# Altium schematic sheet Main.SchDoc
size A4; SheetNumber: 1; SheetTotal: 7
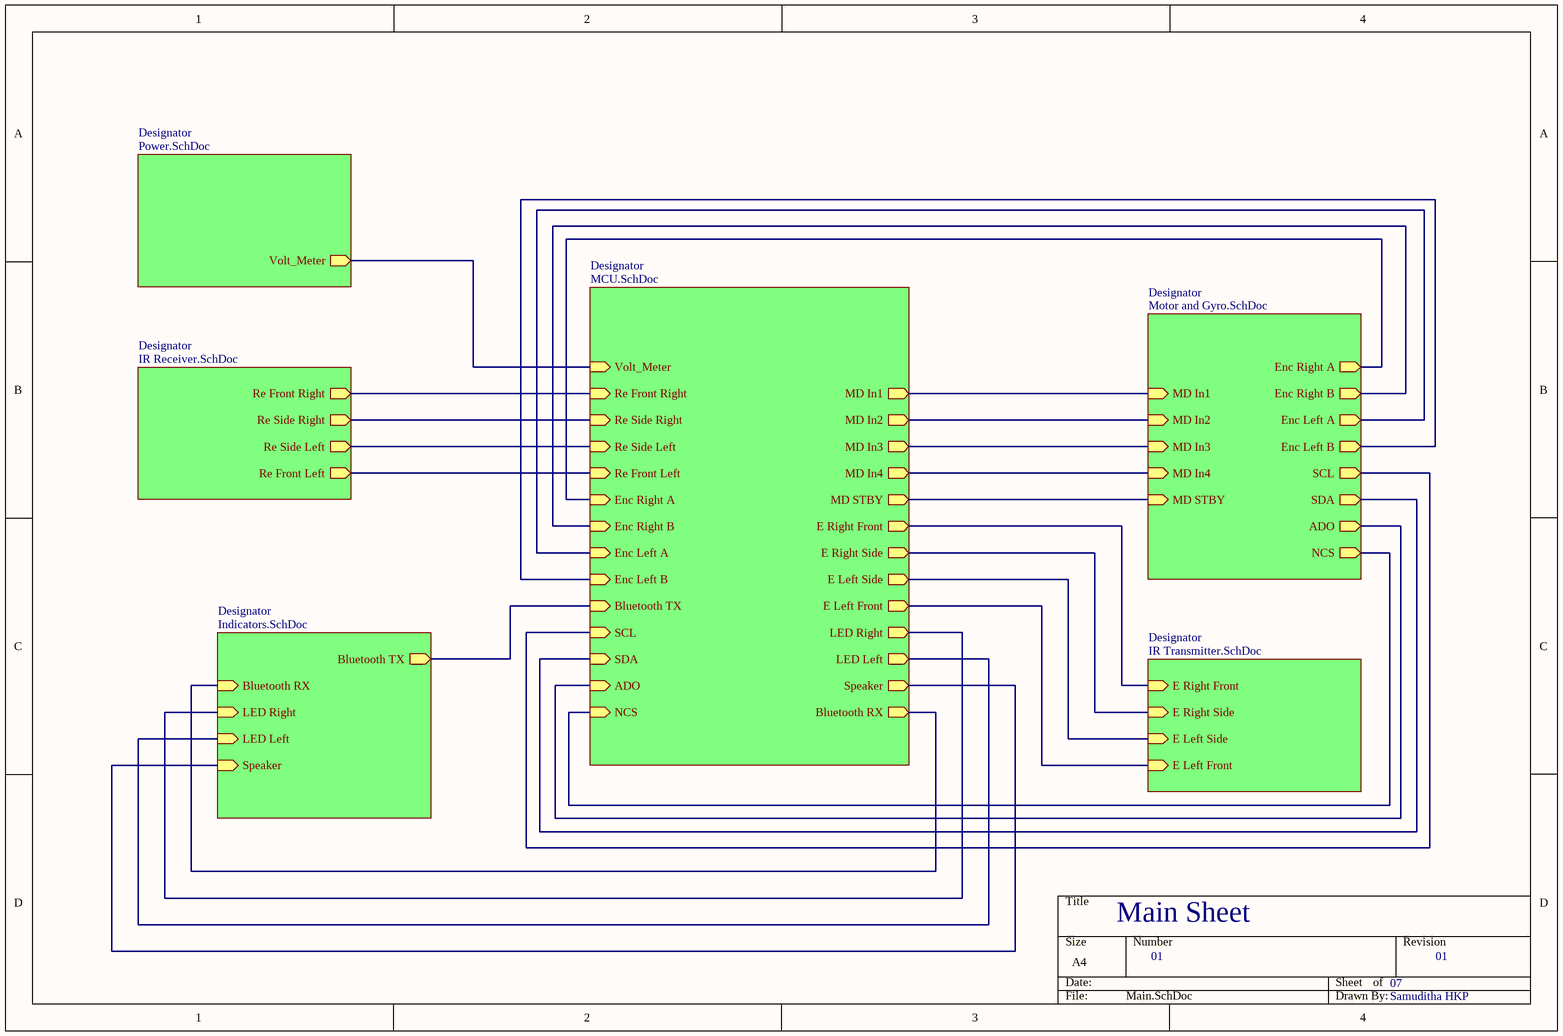
[diagram p0: Main.SchDoc]

## Sub-sheets
Designator = Power.SchDoc: Volt_Meter (out)
Designator = IR Receiver.SchDoc: Re Front Right (out), Re Side Right (out), Re Side Left (out), Re Front Left (out)
Designator = Indicators.SchDoc: Bluetooth RX (in), LED Right (in), LED Left (in), Speaker (in), Bluetooth TX (out)
Designator = MCU.SchDoc: Volt_Meter (in), Re Front Right (in), Re Side Right (in), Re Side Left (in), Re Front Left (in), Enc Right A (in), Enc Right B (in), Enc Left A (in), Enc Left B (in), Bluetooth TX (in), SCL (in), SDA (in), ADO (in), NCS (in), MD In1 (out), MD In2 (out), MD In3 (out), MD In4 (out), E Right Front (out), E Right Side (out), E Left Side (out), E Left Front (out), LED Right (out), LED Left (out), Speaker (out), Bluetooth RX (out), MD STBY (out)
Designator = Motor and Gyro.SchDoc: SCL (out), SDA (out), ADO (out), NCS (out), Enc Right A (out), Enc Right B (out), Enc Left A (out), Enc Left B (out), MD In1 (in), MD In2 (in), MD In3 (in), MD In4 (in), MD STBY (in)
Designator = IR Transmitter.SchDoc: E Right Front (in), E Right Side (in), E Left Side (in), E Left Front (in)

## Nets
(unnamed): sheet Designator/Volt_Meter, sheet Designator/Volt_Meter
(unnamed): sheet Designator/Re Front Right, sheet Designator/Re Front Right
(unnamed): sheet Designator/Re Side Right, sheet Designator/Re Side Right
(unnamed): sheet Designator/Re Side Left, sheet Designator/Re Side Left
(unnamed): sheet Designator/Re Front Left, sheet Designator/Re Front Left
(unnamed): sheet Designator/Bluetooth RX, sheet Designator/Bluetooth RX
(unnamed): sheet Designator/LED Right, sheet Designator/LED Right
(unnamed): sheet Designator/LED Left, sheet Designator/LED Left
(unnamed): sheet Designator/Speaker, sheet Designator/Speaker
(unnamed): sheet Designator/Bluetooth TX, sheet Designator/Bluetooth TX
(unnamed): sheet Designator/Enc Right A, sheet Designator/Enc Right A
(unnamed): sheet Designator/Enc Right B, sheet Designator/Enc Right B
(unnamed): sheet Designator/Enc Left A, sheet Designator/Enc Left A
(unnamed): sheet Designator/Enc Left B, sheet Designator/Enc Left B
(unnamed): sheet Designator/SCL, sheet Designator/SCL
(unnamed): sheet Designator/SDA, sheet Designator/SDA
(unnamed): sheet Designator/ADO, sheet Designator/ADO
(unnamed): sheet Designator/NCS, sheet Designator/NCS
(unnamed): sheet Designator/MD In1, sheet Designator/MD In1
(unnamed): sheet Designator/MD In2, sheet Designator/MD In2
(unnamed): sheet Designator/MD In3, sheet Designator/MD In3
(unnamed): sheet Designator/MD In4, sheet Designator/MD In4
(unnamed): sheet Designator/E Right Front, sheet Designator/E Right Front
(unnamed): sheet Designator/E Right Side, sheet Designator/E Right Side
(unnamed): sheet Designator/E Left Side, sheet Designator/E Left Side
(unnamed): sheet Designator/E Left Front, sheet Designator/E Left Front
(unnamed): sheet Designator/MD STBY, sheet Designator/MD STBY

## Notes on the sheet
- Main Sheet
- 01
- 07
- Samuditha HKP